# Altium schematic sheet MCU.SchDoc
size A4
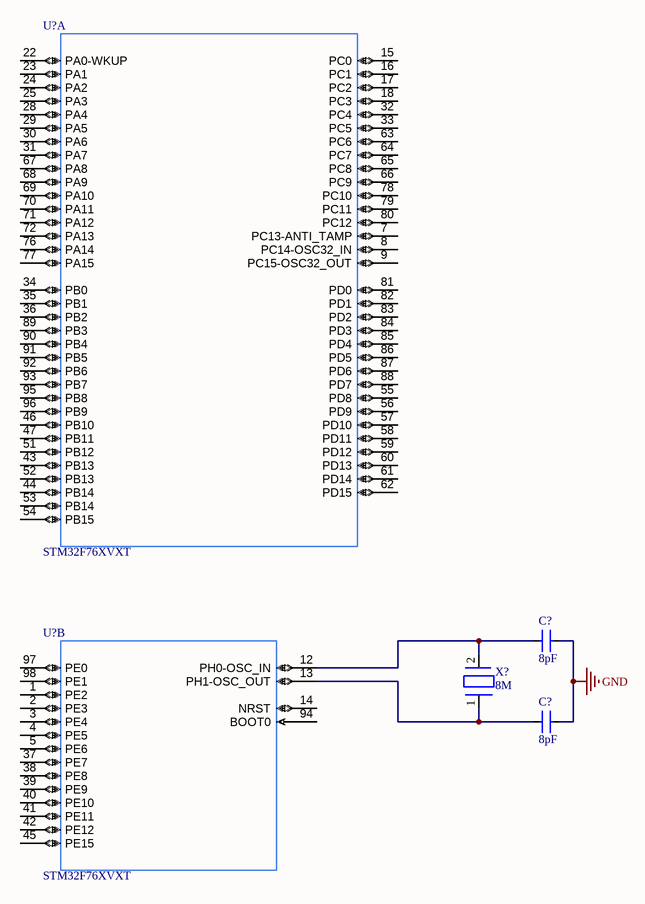
[diagram p0: MCU.SchDoc]

## Parts
(Parts that share a designator on the sheet are numbered #1, #2 ... from top to bottom, then left to right.)
C?#1  8pF  [0603C_B]
C?#2  8pF  [0603C_B]
U?#1  STM32F76XVXT  [LQFP-100_14X14mm]  (part A of 3)
U?#2  STM32F76XVXT  [LQFP-100_14X14mm]  (part B of 3)
X?  8M  [XTAL-SMD2_50X32]

## Nets
GND: C?#1.2 C?#2.2
NetC?#1_1: C?#1.1 U?#2.12(PH0-OSC_IN) X?.2
NetC?#2_1: C?#2.1 U?#2.13(PH1-OSC_OUT) X?.1

Not connected (* = marked no-connect by the designer): U?#1 7(PC13-ANTI_TAMP) 8(PC14-OSC32_IN) 9(PC15-OSC32_OUT) 15(PC0) 16(PC1) 17(PC2) 18(PC3) 22(PA0-WKUP) 23(PA1) 24(PA2) 25(PA3) 28(PA4) 29(PA5) 30(PA6) 31(PA7) 32(PC4) 33(PC5) 34(PB0) 35(PB1) 36(PB2) 43(PB13) 44(PB14) 46(PB10) 47(PB11) 51(PB12) 52(PB13) 53(PB14) 54(PB15) 55(PD8) 56(PD9) 57(PD10) 58(PD11) 59(PD12) 60(PD13) 61(PD14) 62(PD15) 63(PC6) 64(PC7) 65(PC8) 66(PC9) 67(PA8) 68(PA9) 69(PA10) 70(PA11) 71(PA12) 72(PA13) 76(PA14) 77(PA15) 78(PC10) 79(PC11) 80(PC12) 81(PD0) 82(PD1) 83(PD2) 84(PD3) 85(PD4) 86(PD5) 87(PD6) 88(PD7) 89(PB3) 90(PB4) 91(PB5) 92(PB6) 93(PB7) 95(PB8) 96(PB9); U?#2 1(PE2) 2(PE3) 3(PE4) 4(PE5) 5(PE6) 14(NRST) 37(PE7) 38(PE8) 39(PE9) 40(PE10) 41(PE11) 42(PE12) 45(PE15) 94(BOOT0) 97(PE0) 98(PE1)

## Library data of the parts
C?#1 C?#2 = CAP: 普通小电容; Value: 8pF
U?#1 U?#2 = STM32F76XVXT: Imported; Vendor: STMicroelectronics; C: Copyright (C) 2016 Accelerated Designs. All rights reserved; Manufacturer_Part_Number: stm32f76xvxt; Copyright: Copyright (C) 2016 Accelerated Designs. All rights reserved; RefDes: RefDes; Type: Type; Value: Value
X? = XTAL: 无源晶振